# Altium schematic sheet TSAL23.SchDoc
size A4; SheetNumber: 1; SheetTotal: 1; SPICEModelCacheVIGCHMKC: <root> / <DocumentId>VIGCHMKC</DocumentId> / <CacheFrame Number="0"> / <Model Name="1n4007" Kind="MDL"> / <Text>*1N4007 MCE 8-16-95 / *1000V 1A Si GenPurpose Diode pkg:DIODE0.4 1,2 / .MODEL 1N4007 D(IS=2.55E-9 RS=0.042 N=1.75 TT=5.76E-6 CJO=1.85E-11 / + VJ=0.75 M=0.333 BV=1000 IBV=9.86E-5 )</Text> / </Model> / </CacheFrame> / </root>
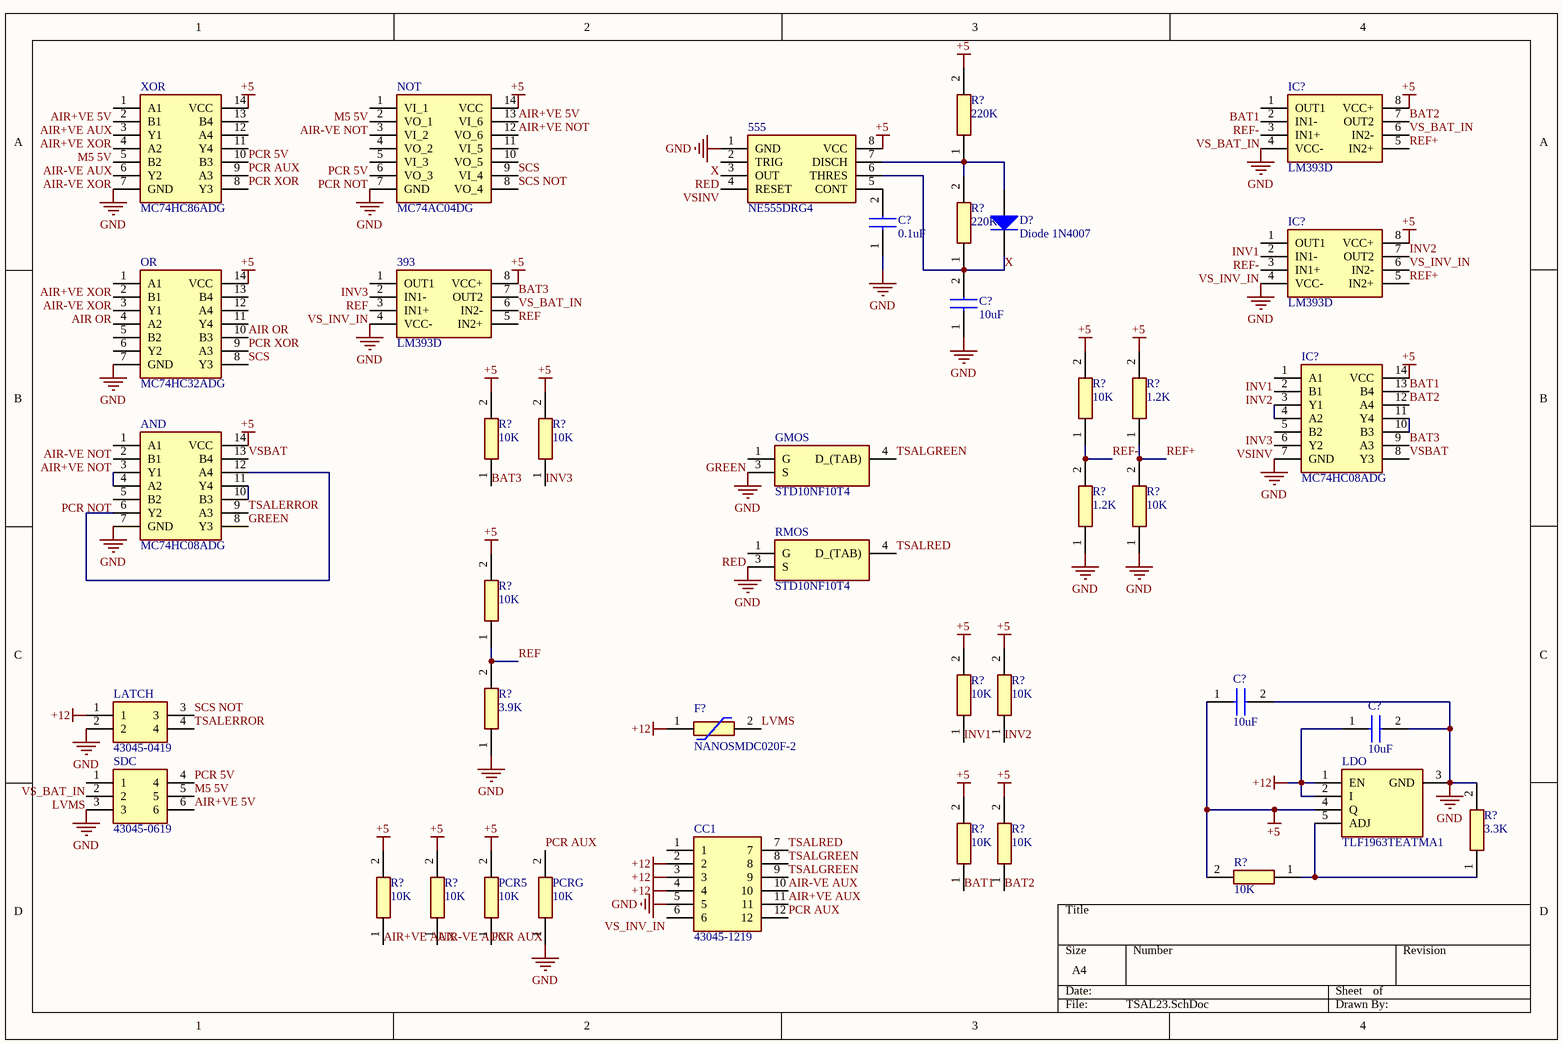
[diagram p0: TSAL23.SchDoc]

## Parts
(Parts that share a designator on the sheet are numbered #1, #2 ... from top to bottom, then left to right.)
393  LM393D  [SOIC127P600X175-8N]
555  NE555DRG4  [SOIC127P600X175-8N]
AND  MC74HC08ADG  [SOIC127P600X175-14N]
C?#1  0.1uF  [CAPC3225X145N]
C?#2  10uF  [CAPC3225X145N]
C?#3  10uF  [CAPC3225X145N]
C?#4  10uF  [CAPC3225X145N]
CC1  43045-1219  [43045-12YY_181920]
D?  Diode 1N4007  [DO-41]
F?  NANOSMDC020F-2  [NANOSMDC016F2]
GMOS  STD10NF10T4  [TO228P972X240-3N]
IC?#1  LM393D  [SOIC127P600X175-8N]
IC?#2  LM393D  [SOIC127P600X175-8N]
IC?#3  MC74HC08ADG  [SOIC127P600X175-14N]
LATCH  43045-0419  [43045-04YY_181920]
LDO  TLF1963TEATMA1  [TLF1963TEATMA1]
NOT  MC74AC04DG  [SOIC127P600X175-14N]
OR  MC74HC32ADG  [SOIC127P600X175-14N]
PCR5  10K  [RESC3126X60N]
PCRG  10K  [RESC3126X60N]
R?#1  220K  [RESC3126X60N]
R?#2  220K  [RESC3126X60N]
R?#3  10K  [RESC3126X60N]
R?#4  1.2K  [RESC3126X60N]
R?#5  10K  [RESC3126X60N]
R?#6  10K  [RESC3126X60N]
R?#7  1.2K  [RESC3126X60N]
R?#8  10K  [RESC3126X60N]
R?#9  10K  [RESC3126X60N]
R?#10  10K  [RESC3126X60N]
R?#11  10K  [RESC3126X60N]
R?#12  3.9K  [RESC3126X60N]
R?#13  10K  [RESC3126X60N]
R?#14  3.3K  [RESC3126X60N]
R?#15  10K  [RESC3126X60N]
R?#16  10K  [RESC3126X60N]
R?#17  10K  [RESC3126X60N]
R?#18  10K  [RESC3126X60N]
RMOS  STD10NF10T4  [TO228P972X240-3N]
SDC  43045-0619  [43045-06YY_181920]
XOR  MC74HC86ADG  [SOIC127P600X175-14N]

## Nets
+5: 393.8(VCC+) 555.8(VCC) AND.14(VCC) C?#3.1 IC?#1.8(VCC+) IC?#2.8(VCC+) IC?#3.14(VCC) LDO.4(Q) NOT.14(VCC) OR.14(VCC) PCR5.2 R?#1.2 R?#3.2 R?#4.2 R?#5.2 R?#6.2 R?#9.2 R?#10.2 R?#11.2 R?#13.2 R?#15.2 R?#16.2 R?#17.2 R?#18.2 XOR.14(VCC)
+12: C?#4.1 CC1.2 CC1.3 CC1.4 F?.1 LATCH.1 LDO.1(EN) LDO.2(I)
GND: 393.4(VCC-) 555.1(GND) AND.7(GND) C?#1.1 C?#2.1 C?#3.2 C?#4.2 CC1.5 GMOS.3(S) IC?#1.4(VCC-) IC?#2.4(VCC-) IC?#3.7(GND) LATCH.2 LDO.3(GND) NOT.7(GND) OR.7(GND) PCRG.1 R?#7.1 R?#8.1 R?#12.1 R?#14.2 RMOS.3(S) SDC.3 XOR.7(GND)
AIR OR: OR.3(Y1) OR.10(B3)
AIR+VE 5V: NOT.13(VI_6) SDC.6 XOR.1(A1)
AIR+VE AUX: CC1.11 R?#17.1 XOR.2(B1)
AIR+VE NOT: AND.2(B1) NOT.12(VO_6)
AIR+VE XOR: OR.1(A1) XOR.3(Y1)
AIR-VE AUX: CC1.10 R?#18.1 XOR.5(B2)
AIR-VE NOT: AND.1(A1) NOT.2(VO_1)
AIR-VE XOR: OR.2(B1) XOR.6(Y2)
BAT1: IC?#1.1(OUT1) IC?#3.13(B4) R?#15.1
BAT2: IC?#1.7(OUT2) IC?#3.12(A4) R?#16.1
BAT3: 393.7(OUT2) IC?#3.9(A3) R?#5.1
GREEN: AND.8(Y3) GMOS.1(G)
INV1: IC?#2.1(OUT1) IC?#3.1(A1) R?#10.1
INV2: IC?#2.7(OUT2) IC?#3.2(B1) R?#11.1
INV3: 393.1(OUT1) IC?#3.5(B2) R?#6.1
LVMS: F?.2 SDC.2
M5 5V: NOT.1(VI_1) SDC.5 XOR.4(A2)
PCR 5V: NOT.5(VI_3) SDC.4 XOR.10(B3)
PCR AUX: CC1.12 PCR5.1 PCRG.2 XOR.9(A3)
PCR NOT: AND.5(B2) NOT.6(VO_3)
PCR XOR: OR.9(A3) XOR.8(Y3)
RED: 555.3(OUT) RMOS.1(G)
REF: 393.2(IN1-) 393.5(IN2+) R?#9.1 R?#12.2
REF+: IC?#1.5(IN2+) IC?#2.5(IN2+) R?#4.1 R?#8.2
REF-: IC?#1.2(IN1-) IC?#2.2(IN1-) R?#3.1 R?#7.2
SCS: NOT.9(VI_4) OR.8(Y3)
SCS NOT: LATCH.3 NOT.8(VO_4)
TSALERROR: AND.9(A3) LATCH.4
TSALGREEN: CC1.8 CC1.9 GMOS.4(D_(TAB))
TSALRED: CC1.7 RMOS.4(D_(TAB))
VS_BAT_IN: 393.6(IN2-) IC?#1.3(IN1+) IC?#1.6(IN2-) SDC.1
VS_INV_IN: 393.3(IN1+) CC1.6 IC?#2.3(IN1+) IC?#2.6(IN2-)
VSBAT: AND.13(B4) IC?#3.8(Y3)
VSINV: 555.4(RESET) IC?#3.6(Y2)
X: 555.2(TRIG) 555.6(THRES) C?#2.2 D?.2(K) R?#2.1
Net555_5: 555.5(CONT) C?#1.2
Net555_7: 555.7(DISCH) D?.1(A) R?#1.1 R?#2.2
NetAND_3: AND.3(Y1) AND.4(A2)
NetAND_6: AND.6(Y2) AND.12(A4)
NetAND_10: AND.10(B3) AND.11(Y4)
NetIC?#3_3: IC?#3.3(Y1) IC?#3.4(A2)
NetIC?#3_10: IC?#3.10(B3) IC?#3.11(Y4)
NetLDO_5: LDO.5(ADJ) R?#13.1 R?#14.1

Not connected (* = marked no-connect by the designer): CC1 1; NOT 3(VI_2) 4(VO_2) 10(VO_5) 11(VI_5); OR 4(A2) 5(B2) 6(Y2) 11(Y4) 12(A4) 13(B4); XOR 11(Y4) 12(A4) 13(B4)

## Library data of the parts
393 IC?#1 IC?#2 = LM393D: Integrated Circuit; Manufacturer_Name: STMicroelectronics; Datasheet Link: http://www.st.com/st-web-ui/static/active/en/resource/technical/document/datasheet/CD00000465.pdf; Height: 1.75mm; Manufacturer_Part_Number: LM393D; Mouser Part Number: 511-LM393D; Mouser Price/Stock: https://www.mouser.co.uk/ProductDetail/STMicroelectronics/LM393D?qs=htKRmzjvioSpfPyLiLnV1A%3D%3D; Arrow Part Number: LM393D; Arrow Price/Stock: https://www.arrow.com/en/products/lm393d/stmicroelectronics?region=europe
555 = NE555DRG4: Integrated Circuit; Manufacturer_Name: Texas Instruments; Datasheet Link: http://www.mouser.com/ds/2/405/ne555-557499.pdf; Height: 1.75mm; Manufacturer_Part_Number: NE555DRG4; Mouser Part Number: 595-NE555DRG4; Mouser Price/Stock: https://www.mouser.co.uk/ProductDetail/Texas-Instruments/NE555DRG4?qs=rLYyFdxB%2FmreBHawQCpQ0Q%3D%3D; Arrow Part Number: NE555DRG4; Arrow Price/Stock: https://www.arrow.com/en/products/ne555drg4/texas-instruments?region=nac
AND IC?#3 = MC74HC08ADG: Integrated Circuit; Manufacturer_Name: ON Semiconductor; Datasheet Link: http://www.onsemi.com/pub/Collateral/MC74HC08A-D.PDF; Height: 1.75mm; Manufacturer_Part_Number: MC74HC08ADG; Mouser Part Number: 863-MC74HC08ADG; Mouser Price/Stock: https://www.mouser.co.uk/ProductDetail/ON-Semiconductor/MC74HC08ADG?qs=qg33o%252B8vzFqW0duu5mW%2FLA%3D%3D; Arrow Part Number: MC74HC08ADG; Arrow Price/Stock: https://www.arrow.com/en/products/mc74hc08adg/on-semiconductor
C?#1-C?#4 = CC1210KKX7R8BB105: Capacitor; Manufacturer_Name: YAGEO (PHYCOMP); Datasheet Link: https://datasheet.datasheetarchive.com/originals/distributors/Datasheets_SAMA/d9f127a4875522309d99aa7dec79633c.pdf; Height: 1.45mm; Manufacturer_Part_Number: CC1210KKX7R8BB105; Mouser Part Number: 603-CC121KKX7R8BB105; Mouser Price/Stock: https://www.mouser.com/Search/Refine.aspx?Keyword=603-CC121KKX7R8BB105; Arrow Part Number: CC1210KKX7R8BB105; Arrow Price/Stock: https://www.arrow.com/en/products/cc1210kkx7r8bb105/yageo?region=nac
CC1 = 43045-1219: Connector; Manufacturer_Name: Molex; Datasheet Link: https://www.molex.com/pdm_docs/sd/430450218_sd.pdf; Height: 9.91mm; Manufacturer_Part_Number: 43045-1219; Mouser Part Number: 538-43045-1219; Mouser Price/Stock: https://www.mouser.co.uk/ProductDetail/Molex/43045-1219?qs=359VwiUTsp3iCU2NVYxNVg%3D%3D
D? = Diode 1N4007: 1 Amp General Purpose Rectifier; Published: 8-Jun-2000; LatestRevisionDate: 17-Jul-2002; LatestRevisionNote: Re-released for DXP Platform.; DatasheetVersion: 1998; PackageVersion: Aug-1999; PackageReference: DO-41; Publisher: Altium Limited; PackageDescription: Diode, Axial; Body 5.2 x 2.7 mm (LxDia. max), Lead Dia. 0.86 mm (max); Code_JEDEC: DO-204-AL; ComponentLink1Description: Manufacturer Link; ComponentLink1URL: http://www.fairchildsemi.com/; ComponentLink2Description: Datasheet; ComponentLink2URL: http://www.fairchildsemi.com/ds/1N%2F1N4001.pdf
F? = NANOSMDC020F-2: Resettable Fuse; Manufacturer_Name: LITTELFUSE; Datasheet Link: https://www.littelfuse.com/~/media/electronics/datasheets/resettable_ptcs/littelfuse_ptc_nanosmdc_datasheet.pdf.pdf; Height: 1mm; Manufacturer_Part_Number: NANOSMDC020F-2; Mouser Part Number: 650-NANOSMDC020F-2; Mouser Price/Stock: https://www.mouser.co.uk/ProductDetail/Littelfuse/NANOSMDC020F-2?qs=iK0evp%252BCRRU6agwMt7HYjg%3D%3D; Arrow Part Number: NANOSMDC020F-2; Arrow Price/Stock: https://www.arrow.com/en/products/nanosmdc020f-2/littelfuse
GMOS RMOS = STD10NF10T4: Integrated Circuit; Manufacturer_Name: STMicroelectronics; Datasheet Link: http://www.st.com/web/en/resource/technical/document/datasheet/CD00002133.pdf; Height: 2.4mm; Manufacturer_Part_Number: STD10NF10T4; Mouser Part Number: 511-STD10NF10; Mouser Price/Stock: https://www.mouser.co.uk/ProductDetail/STMicroelectronics/STD10NF10T4?qs=El1T93pd01%2FBh%252BX9NfIsIQ%3D%3D; Arrow Part Number: STD10NF10T4; Arrow Price/Stock: https://www.arrow.com/en/products/std10nf10t4/stmicroelectronics
LATCH = 43045-0419: Connector; Manufacturer_Name: Molex; Datasheet Link: https://www.molex.com/pdm_docs/sd/430450218_sd.pdf; Height: 9.91mm; Manufacturer_Part_Number: 43045-0419; Mouser Part Number: 538-43045-0419; Mouser Price/Stock: https://www.mouser.co.uk/ProductDetail/Molex/43045-0419?qs=UeCeOHRHQebVNIQyI9VWWg%3D%3D
LDO = TLF1963TEATMA1: Integrated Circuit; Manufacturer_Name: Infineon; Datasheet Link: https://www.infineon.com/dgdl/Infineon-TLF1963-DS-v01_00-EN.pdf?fileId=5546d46258fc0bc1015969d2981941e0; Height: 2.35mm; Manufacturer_Part_Number: TLF1963TEATMA1; Mouser Part Number: 726-TLF1963TEATMA1; Mouser Price/Stock: https://www.mouser.co.uk/ProductDetail/Infineon-Technologies/TLF1963TEATMA1?qs=SiyfpgnvCZluIGE%2FbZiglw%3D%3D; Arrow Part Number: TLF1963TEATMA1; Arrow Price/Stock: https://www.arrow.com/en/products/tlf1963teatma1/infineon-technologies-ag?region=nac
NOT = MC74AC04DG: Integrated Circuit; Manufacturer_Name: ON Semiconductor; Datasheet Link: https://www.onsemi.com/pub/Collateral/MC74AC04-D.PDF; Height: 1.75mm; Manufacturer_Part_Number: MC74AC04DG; Mouser Part Number: 863-MC74AC04DG; Mouser Price/Stock: https://www.mouser.co.uk/ProductDetail/ON-Semiconductor/MC74AC04DG?qs=dFKnUM%2FquJbTyBC81Rgreg%3D%3D; Arrow Part Number: MC74AC04DG; Arrow Price/Stock: https://www.arrow.com/en/products/mc74ac04dg/on-semiconductor
OR = MC74HC32ADG: Integrated Circuit; Manufacturer_Name: ON Semiconductor; Datasheet Link: http://www.onsemi.com/pub/Collateral/MC74HC32A-D.PDF; Height: 1.75mm; Manufacturer_Part_Number: MC74HC32ADG; Mouser Part Number: 863-MC74HC32ADG; Mouser Price/Stock: https://www.mouser.co.uk/ProductDetail/ON-Semiconductor/MC74HC32ADG?qs=qg33o%252B8vzFqwIcd4MqFgRQ%3D%3D; Arrow Part Number: MC74HC32ADG; Arrow Price/Stock: https://www.arrow.com/en/products/mc74hc32adg/on-semiconductor
PCR5 PCRG R?#1-R?#18 = RC1210JR-070RL: Resistor; Manufacturer_Name: YAGEO (PHYCOMP); Datasheet Link: https://datasheet.datasheetarchive.com/originals/distributors/Datasheets_SAMA/902f9e387b938f871d31120f5fc1d65e.pdf; Height: 0.6mm; Manufacturer_Part_Number: RC1210JR-070RL; Mouser Part Number: 603-RC1210JR-070RL; Mouser Price/Stock: https://www.mouser.co.uk/ProductDetail/YAGEO/RC1210JR-070RL?qs=eVUp2xEqV%2FtpfK61W3Q4CQ%3D%3D; Arrow Part Number: RC1210JR-070RL; Arrow Price/Stock: https://www.arrow.com/en/products/rc1210jr-070rl/yageo
SDC = 43045-0619: Connector; Manufacturer_Name: Molex; Datasheet Link: https://www.molex.com/pdm_docs/sd/430450218_sd.pdf; Height: 9.91mm; Manufacturer_Part_Number: 43045-0619; Mouser Part Number: 538-43045-0619; Mouser Price/Stock: https://www.mouser.co.uk/ProductDetail/Molex/43045-0619?qs=KC2ywxza1kr7EVu5MuTw7g%3D%3D; Arrow Part Number: 43045-0619; Arrow Price/Stock: https://www.arrow.com/en/products/43045-0619/molex
XOR = MC74HC86ADG: Integrated Circuit; Manufacturer_Name: onsemi; Datasheet Link: https://www.onsemi.com/pub/Collateral/MC74HC86A-D.PDF; Height: 1.75mm; Manufacturer_Part_Number: MC74HC86ADG; Mouser Part Number: 863-MC74HC86ADG; Mouser Price/Stock: https://www.mouser.co.uk/ProductDetail/onsemi/MC74HC86ADG?qs=qg33o%252B8vzFo7NVdnNP3ThA%3D%3D